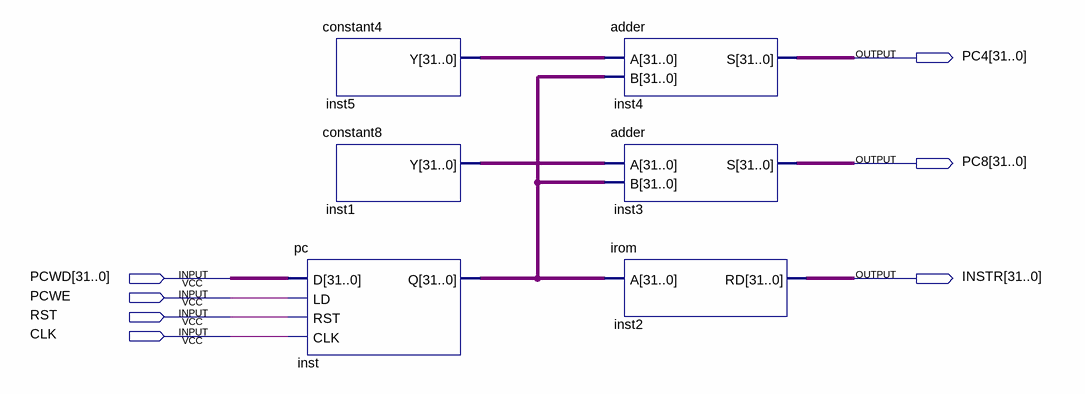
[diagram p0: schematic sheet]
// Quartus schematic fetch.bdf as structural Verilog: 6 symbols, 7 pins
module fetch (
  input  [31:0] PCWD,
  input  PCWE,
  input  RST,
  input  CLK,
  output [31:0] PC4,
  output [31:0] PC8,
  output [31:0] INSTR
);

  wire [31:0] inst1_y, inst5_y, inst_q;

  pc inst (.D(PCWD), .LD(PCWE), .RST(RST), .CLK(CLK), .Q(inst_q));
  constant4 inst5 (.Y(inst5_y));
  constant8 inst1 (.Y(inst1_y));
  adder inst4 (.A(inst5_y), .B(inst_q), .S(PC4));
  adder inst3 (.A(inst1_y), .B(inst_q), .S(PC8));
  irom inst2 (.A(inst_q), .RD(INSTR));
endmodule
